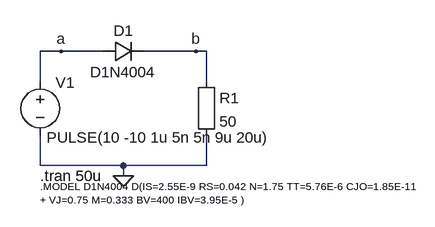
[diagram p0: schematic trr_1n4004.asc]
trr_1n4004.asc, the LTspice schematic file:
Version 4
SHEET 1 880 680
WIRE -176 144 -208 144
WIRE -112 144 -176 144
WIRE 32 144 -48 144
WIRE 48 144 32 144
WIRE -208 192 -208 144
WIRE 48 192 48 144
WIRE -208 320 -208 272
WIRE -80 320 -208 320
WIRE 48 320 48 272
WIRE 48 320 -80 320
WIRE -80 336 -80 320
FLAG -80 336 0
FLAG -176 144 a
FLAG 32 144 b
SYMBOL diode -112 160 R270
WINDOW 0 32 32 VTop 2
WINDOW 3 0 32 VBottom 2
SYMATTR InstName D1
SYMATTR Value D1N4004
SYMBOL Misc\\EuropeanResistor 32 176 R0
SYMATTR InstName R1
SYMATTR Value 50
SYMBOL voltage -208 176 R0
WINDOW 123 0 0 Left 2
WINDOW 39 0 0 Left 2
WINDOW 3 10 101 Left 2
SYMATTR Value PULSE(10 -10 1u 5n 5n 9u 20u)
SYMATTR InstName V1
TEXT -208 336 Left 2 !.tran 50u
TEXT -208 352 Left 1 !.MODEL D1N4004 D(IS=2.55E-9 RS=0.042 N=1.75 TT=5.76E-6 CJO=1.85E-11 \n+ VJ=0.75 M=0.333 BV=400 IBV=3.95E-5 )

The netlist it stands for:
* trr_1n4004.asc
D1 a b D1N4004
R1 b 0 50
V1 a 0 PULSE(10 -10 1u 5n 5n 9u 20u)
.model D D
.lib standard.dio
.tran 50u
.MODEL D1N4004 D(IS=2.55E-9 RS=0.042 N=1.75 TT=5.76E-6 CJO=1.85E-11
+ VJ=0.75 M=0.333 BV=400 IBV=3.95E-5 )
.backanno
.end